# Altium project HW_RV_TOUCH_R1M1.PrjPcb (part 3 of 4)

## Sheet 10_USB_HOST.SchDoc: =TitleParameter
size A3; Address: Crete IL; Organization: ASISGUARD; Address1: Kemalpasa, Kemalpasa Cd. No:290 D:292H, 35060 Bornova/Izmir/Turkey; Revision: R1M1
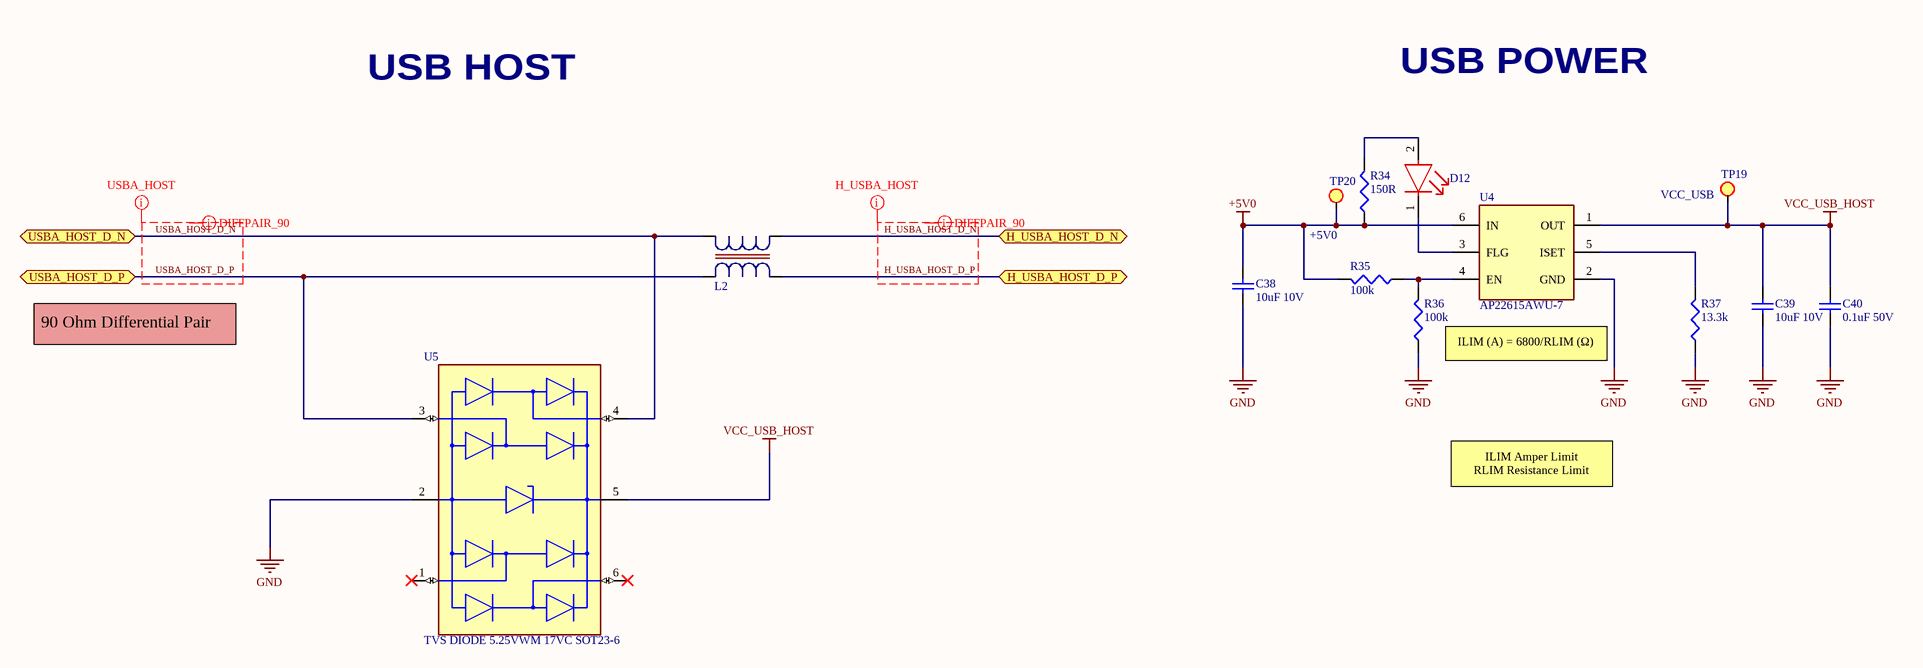
[diagram p9: 10_USB_HOST.SchDoc]

### Parts
C38  value 10uF 10V  [SMC0603]  (hidden comment: CAP CER 10UF 10V X5R 0603)
C39  value 10uF 10V  [SMC0603]  (hidden comment: CAP CER 10UF 10V X5R 0603)
C40  value 0.1uF 50V  [CAP0402(1005)x0.5]  (hidden comment: CAP CER 0.1UF 50V X7R 0402)
D12  LED RED CLEAR SMD  [Lite-On_0_MFG]  (value not drawn)
L2  CMC 100MA 2LN 90 OHM SMD  [IND_MCZ1210AH_TDK]  (value not drawn)
R34  value 150R  [SMR0603]  (hidden comment: RES 150 OHM 1% 1/10W 0603)
R35  value 100k  [RES0402(1005)]  (hidden comment: RES 100K OHM 1% 1/16W 0402)
R36  value 100k  [RES0402(1005)]  (hidden comment: RES 100K OHM 1% 1/16W 0402)
R37  value 13.3k  [RES0402(1005)]  (hidden comment: RES 13.3K OHM 1% 1/16W 0402)
TP19  VCC_USB  [TEST_POINT]
TP20  +5V0  [TEST_POINT]
U4  IC PWR SWTCH N/P-CHAN 1:1 TSOT26  [SOT95P280X100-6N]  (value not drawn)
U5  TVS DIODE 5.25VWM 17VC SOT23-6  [SOT95P280X145-6N]

### Ports
H_USBA_HOST_D_N (bidir), H_USBA_HOST_D_P (bidir), USBA_HOST_D_N (bidir), USBA_HOST_D_P (bidir)

### Nets
+5V0: C38.2 R34.1 R35.2 TP20.1(TP) U4.6(IN)
GND: C38.1 C39.1 C40.1 R36.1 R37.1 U4.2(GND) U5.2(GND)
VCC_USB_HOST: C39.2 C40.2 TP19.1(TP) U4.1(OUT) U5.5(VP)
H_USBA_HOST_D_N: L2.3 ; port H_USBA_HOST_D_N
H_USBA_HOST_D_P: L2.4 ; port H_USBA_HOST_D_P
USBA_HOST_D_N: L2.2 U5.4(I/O3) ; port USBA_HOST_D_N
USBA_HOST_D_P: L2.1 U5.3(I/O2) ; port USBA_HOST_D_P
NetD12_1: D12.1(C) U4.3(FLG)
NetD12_2: D12.2(A) R34.2
NetR35_1: R35.1 R36.2 U4.4(EN)
NetR37_2: R37.2 U4.5(ISET)

Not connected (* = marked no-connect by the designer): U5 1(I/O1)* 6(I/O4)*

### Layout directives
net class USBA_HOST: USBA_HOST_D_N, USBA_HOST_D_P
net class H_USBA_HOST: H_USBA_HOST_D_N, H_USBA_HOST_D_P
differential pair; differential pair class ZDIFF90: H_USBA_HOST_D_N, H_USBA_HOST_D_P, USBA_HOST_D_N, USBA_HOST_D_P

### Notes on the sheet
- USB HOST
- USB POWER
- 90 Ohm Differential Pair
- (near R36) ILIM (A) = 6800/RLIM (Ω)
- ILIM Amper Limit                                                                                     RLIM Resistance Limit
- Proje/Project:
- Sayfa Adı/Document Name:
- Çizilme Tarihi/Drawing Date
- Umit KAYACIK
- Tasarlayan/Designed By
- Sayfa/Sheet:
- Revision:
- of
- Son Güncelleme/Last Edit Date
- Kontrol eden/Checked By
- Onaylayan/Approved By
- Boyut/Size:
- Varyant/Variant:
- Dil/Language:
- A3
- ENG

### Library data of the parts
C38 C39 = CAP0603_10UF_10V: 10 µF ±10% 10V Ceramic Capacitor X5R 0603 (1608 Metric); Manufacturer Part Number: CL10A106KP8NNNC; Order Code: DIGI: 1276-1192-2-ND; Sirius Stock Code: *; LCSC Part Number: C19702; LCSC Manufacturer Part Number: CL10A106KP8NNNC
C40 = CAP0402_0.1UF_50V: 0.1 µF ±10% 50V Ceramic Capacitor X7R 0402 (1005 Metric); Manufacturer Part Number: CL05B104KB54PNC; Order Code: DIGI: 1276-CL05B104KB54PNCTR-ND; Sirius Stock Code: *; LCSC Part Number: C307331; LCSC Manufacturer Part Number: CL05B104KB54PNC
D12 = LTST-C191KRKT: Red 631nm LED Indication - Discrete 2V 0603 (1608 Metric); Order Code: Digi: 160-1447-2-ND; Manufacturer Part Number: LTST-C191KRKT; LCSC Manufacturer Part Number: LTST-C191KRKT; LCSC Part Number: C125099
L2 = MCZ1210AH900L2T: 2 Line Common Mode Choke Surface Mount 90 Ohms @ 100 MHz 100mA DCR 1.75Ohm; Manufacturer Part Number: MCZ1210AH900L2TA0G; LCSC Manufacturer Part Number: MCZ1210AH900L2TD0G; Order Code: Digi: 445-MCZ1210AH900L2TA0GTR-ND; LCSC Part Number: C435268
R34 = RES0603_150R_%1: 150 Ohms ±1% 0.1W, 1/10W Chip Resistor 0603 (1608 Metric) Moisture Resistant Thick Film; Manufacturer Part Number: RC0603FR-07150RL; Order Code: Digi: 311-150HRTR-ND; Sirius Stock Code: *; LCSC Part Number: C114608; LCSC Manufacturer Part Number: RC0603FR-07150RL
R35 R36 = RES0402_100K_%1: 100 kOhms ±1% 0.063W, 1/16W Chip Resistor 0402 (1005 Metric) Moisture Resistant Thick Film; Manufacturer Part Number: RC0402FR-07100KL; Order Code: Digi: 311-100KLRTR-ND; Sirius Stock Code: *; LCSC Part Number: C60491; LCSC Manufacturer Part Number: RC0402FR-07100KL
R37 = RES0402_13K3_%1: Manufacturer Part Number: RC0402FR-0713K3L; Order Code: Digi: YAG2974TR-ND; Sirius Stock Code: *; LCSC Manufacturer Part Number: RC0402FR-0713K3L; LCSC Part Number: C274352
TP19 TP20 = TP_1
U4 = AP22615AWU-7: Power Switch/Driver 1:1 N/P-Channel 3A TSOT-26; Order Code: Digi: AP22615AWU-7DITR-ND; LCSC Manufacturer Part Number: AP22615AWU-7; LCSC Part Number: C2680357; Manufacturer Part Number: AP22615AWU-7
U5 = USBLC6-4SC6: 17V Clamp 5A (8/20µs) Ipp Tvs Diode Surface Mount SOT-23-6; Order Code: Digi: 497-4492-2-ND; Manufacturer Part Number: USBLC6-4SC6; LCSC Manufacturer Part NUmber: USBLC6-4SC6; LCSC Part Number: C111212

## Sheet 11_MYIR.SchDoc: =TitleParameter
size A3; Address: Crete IL; Organization: ASISGUARD; Address1: Kemalpasa, Kemalpasa Cd. No:290 D:292H, 35060 Bornova/Izmir/Turkey; Revision: R1M1
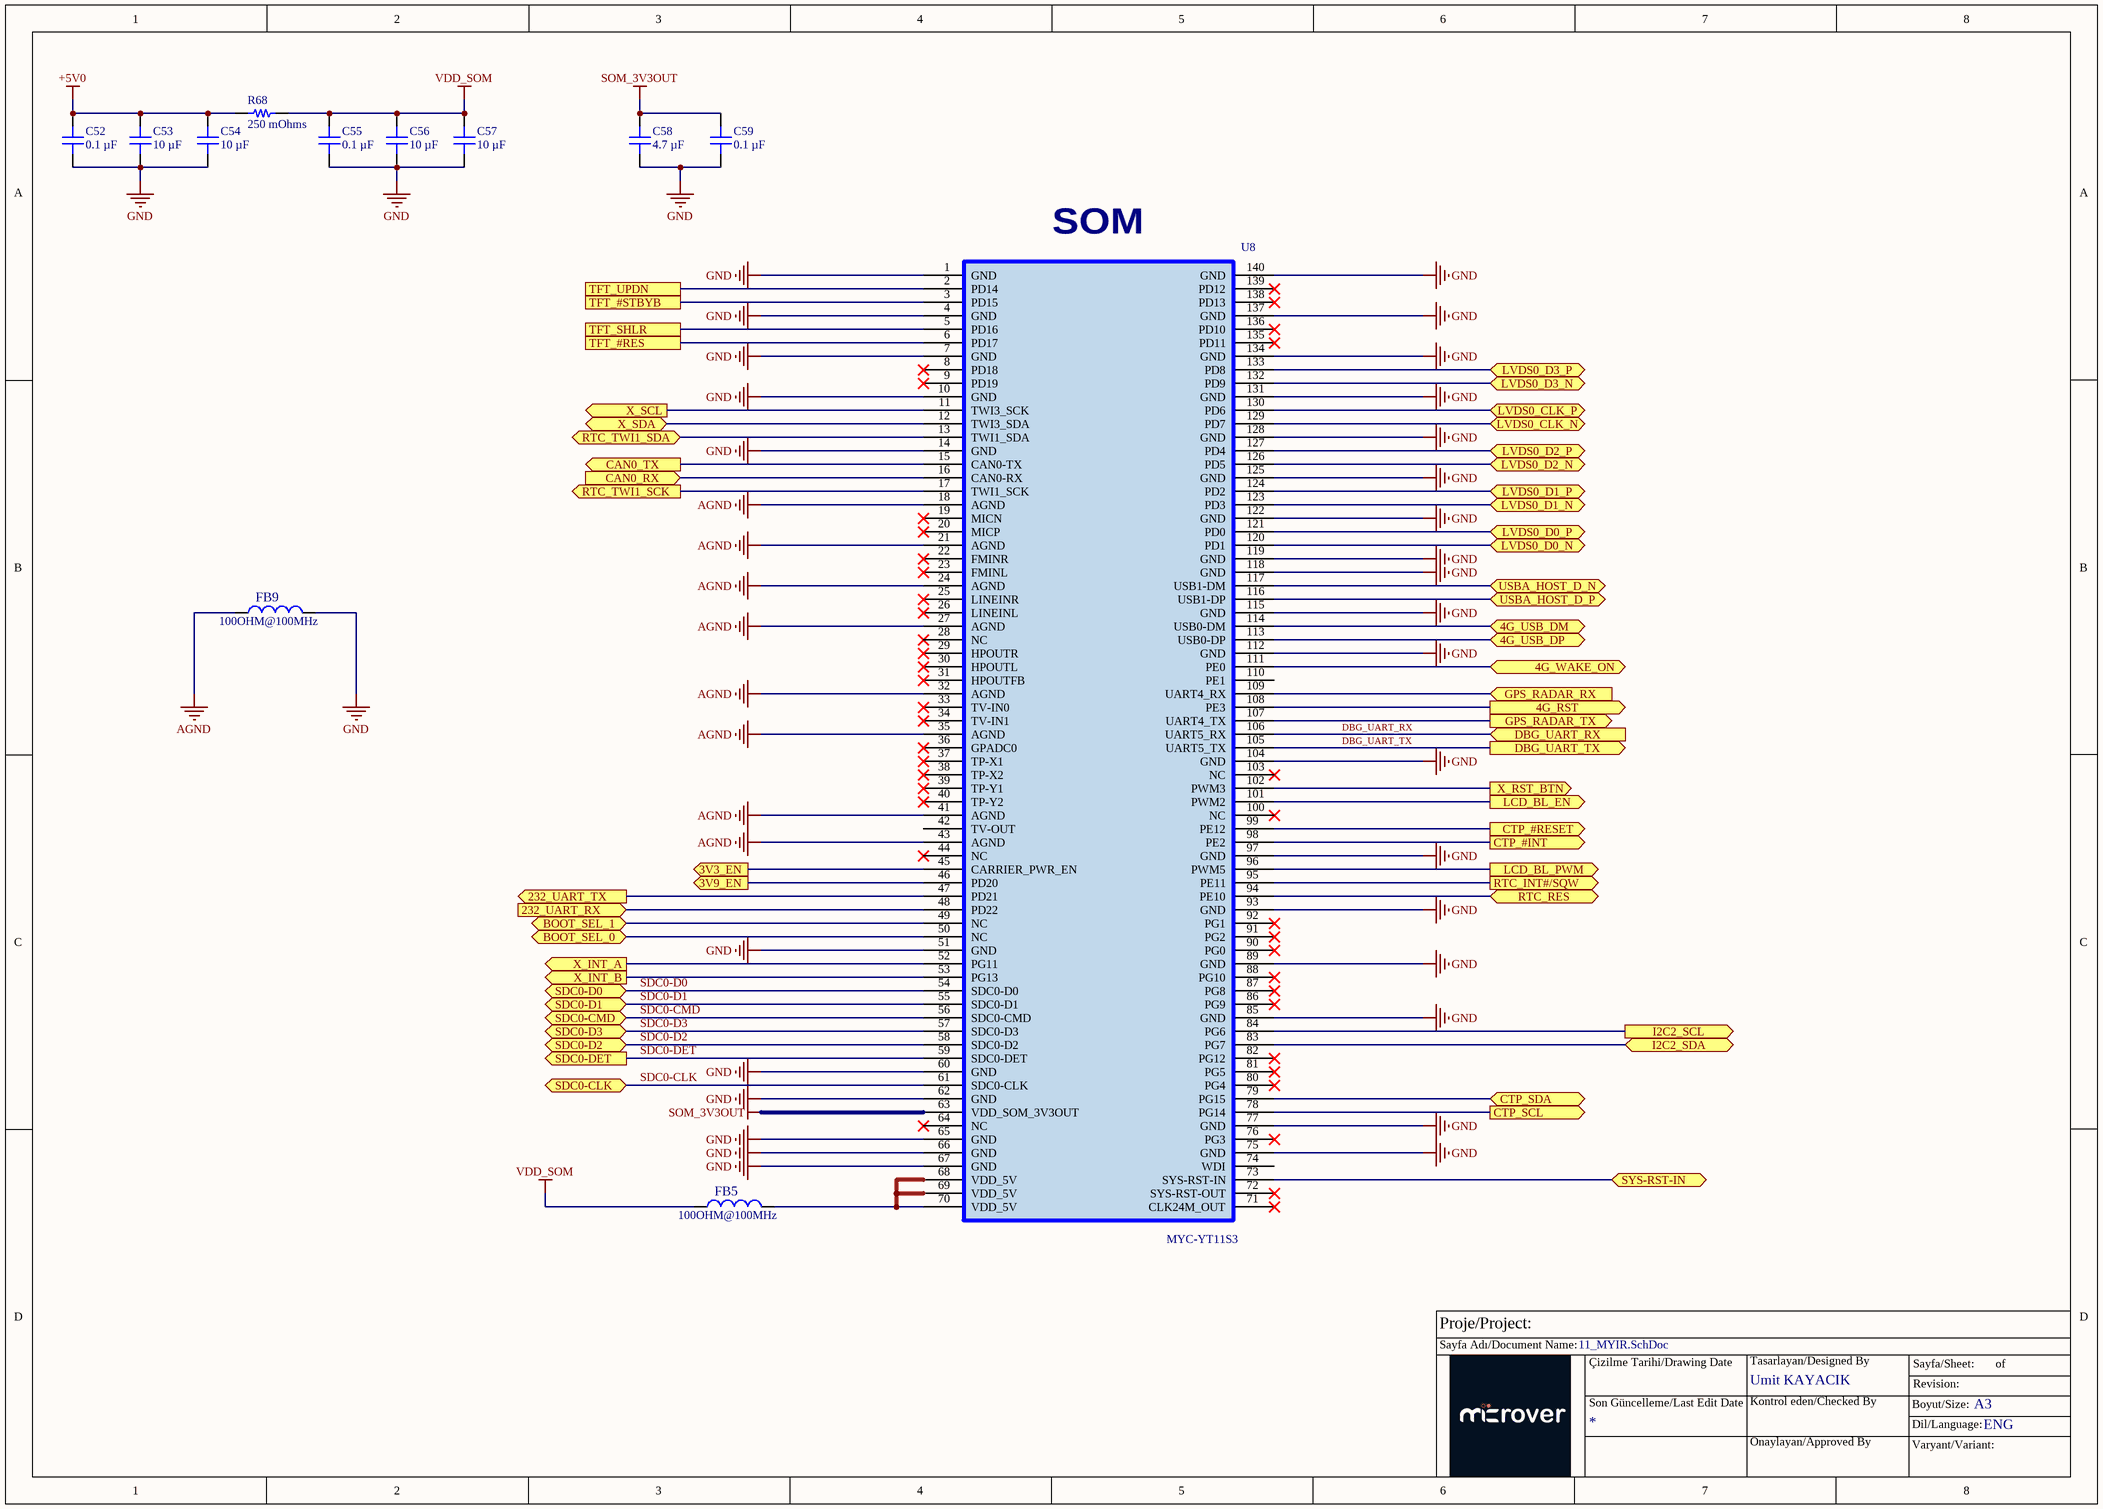
[diagram p10: 11_MYIR.SchDoc]

### Parts
C52  0.1 µF  [CAP 0603_1608]
C53  10 µF  [CAP 0603_1608]
C54  10 µF  [CAP 0603_1608]
C55  0.1 µF  [CAP 0603_1608]
C56  10 µF  [CAP 0603_1608]
C57  10 µF  [CAP 0603_1608]
C58  4.7 µF  [CAP 0603_1608]
C59  0.1 µF  [CAP 0603_1608]
FB5  100OHM@100MHz  [FB 0603(1608)]
FB9  100OHM@100MHz  [FB 0603(1608)]
R68  250 mOhms  [RES 1206_3216]
U8  MYC-YT11S3  [YOUPK37X39_1_00-SMD-148]

### Ports
3V3_EN (out), 3V9_EN (out), 4G_RST (out), 4G_USB_DM (bidir), 4G_USB_DP (bidir), 4G_WAKE_ON (bidir), 232_UART_RX (in), 232_UART_TX (out), BOOT_SEL_0 (bidir), BOOT_SEL_1 (bidir), CAN0_RX (in), CAN0_TX (out), CTP_#INT (out), CTP_#RESET (out), CTP_SCL (out), CTP_SDA (bidir), DBG_UART_RX (in), DBG_UART_TX (out), GPS_RADAR_RX (in), GPS_RADAR_TX (out), I2C2_SCL (out), I2C2_SDA (bidir), LCD_BL_EN (out), LCD_BL_PWM (out), LVDS0_CLK_N (bidir), LVDS0_CLK_P (bidir), LVDS0_D0_N (bidir), LVDS0_D0_P (bidir), LVDS0_D1_N (bidir), LVDS0_D1_P (bidir), LVDS0_D2_N (bidir), LVDS0_D2_P (bidir), LVDS0_D3_N (bidir), LVDS0_D3_P (bidir), RTC_INT#/SQW (out), RTC_RES (bidir), RTC_TWI1_SCK (out), RTC_TWI1_SDA (bidir), SDC0-CLK (bidir), SDC0-CMD (bidir), SDC0-D0 (bidir), SDC0-D1 (bidir), SDC0-D2 (bidir), SDC0-D3 (bidir), SDC0-DET (out), SYS-RST-IN (bidir), TFT_#RES, TFT_#STBYB, TFT_SHLR, TFT_UPDN, USBA_HOST_D_N (bidir), USBA_HOST_D_P (bidir), X_INT_A (out), X_INT_B (out), X_RST_BTN (out), X_SCL (out), X_SDA (bidir)

### Nets
+5V0: C52.2 C53.2 C54.2 R68.2
AGND: FB9.2 U8.18(AGND) U8.21(AGND) U8.24(AGND) U8.27(AGND) U8.32(AGND) U8.35(AGND) U8.41(AGND) U8.43(AGND)
GND: C52.1 C53.1 C54.1 C55.1 C56.1 C57.1 C58.1 C59.1 FB9.1 U8.1(GND) U8.4(GND) U8.7(GND) U8.10(GND) U8.14(GND) U8.51(GND) U8.60(GND) U8.62(GND) U8.65(GND) U8.66(GND) U8.67(GND) U8.75(GND) U8.77(GND) U8.85(GND) U8.89(GND) U8.93(GND) U8.97(GND) U8.104(GND) U8.112(GND) U8.115(GND) U8.118(GND) U8.119(GND) U8.122(GND) U8.125(GND) U8.128(GND) U8.131(GND) U8.134(GND) U8.137(GND) U8.140(GND)
SOM_3V3OUT: C58.2 C59.2 U8.63(VDD_SOM_3V3OUT)
VDD_SOM: C55.2 C56.2 C57.2 FB5.2 R68.1
4G_RST: U8.108(PE3) ; port 4G_RST
4G_USB_N: U8.114(USB0-DM) ; port 4G_USB_DM
4G_USB_P: U8.113(USB0-DP) ; port 4G_USB_DP
CTP_#INT: U8.98(PE2) ; port CTP_#INT
CTP_#RESET: U8.99(PE12) ; port CTP_#RESET
CTP_SCL: U8.78(PG14) ; port CTP_SCL
CTP_SDA: U8.79(PG15) ; port CTP_SDA
DBG_UART_RX: U8.106(UART5_RX) ; port DBG_UART_RX
DBG_UART_TX: U8.105(UART5_TX) ; port DBG_UART_TX
I2C2_SCL: U8.84(PG6) ; port I2C2_SCL
I2C2_SDA: U8.83(PG7) ; port I2C2_SDA
INT#/SQW: U8.95(PE11) ; port RTC_INT#/SQW
LCD_BL_EN: U8.101(PWM2) ; port LCD_BL_EN
LCD_BL_PWM: U8.96(PWM5) ; port LCD_BL_PWM
LVDS0_CLK_N: U8.129(PD7) ; port LVDS0_CLK_N
LVDS0_CLK_P: U8.130(PD6) ; port LVDS0_CLK_P
LVDS0_D0_N: U8.120(PD1) ; port LVDS0_D0_N
LVDS0_D0_P: U8.121(PD0) ; port LVDS0_D0_P
LVDS0_D1_N: U8.123(PD3) ; port LVDS0_D1_N
LVDS0_D1_P: U8.124(PD2) ; port LVDS0_D1_P
LVDS0_D2_N: U8.126(PD5) ; port LVDS0_D2_N
LVDS0_D2_P: U8.127(PD4) ; port LVDS0_D2_P
LVDS0_D3_N: U8.132(PD9) ; port LVDS0_D3_N
LVDS0_D3_P: U8.133(PD8) ; port LVDS0_D3_P
RST_BTN: U8.102(PWM3) ; port X_RST_BTN
RTC_RES: U8.94(PE10) ; port RTC_RES
SDC0-CLK: U8.61(SDC0-CLK) ; port SDC0-CLK
SDC0-CMD: U8.56(SDC0-CMD) ; port SDC0-CMD
SDC0-D0: U8.54(SDC0-D0) ; port SDC0-D0
SDC0-D1: U8.55(SDC0-D1) ; port SDC0-D1
SDC0-D2: U8.58(SDC0-D2) ; port SDC0-D2
SDC0-D3: U8.57(SDC0-D3) ; port SDC0-D3
SDC0-DET: U8.59(SDC0-DET) ; port SDC0-DET
TFT_#RES: U8.6(PD17) ; port TFT_#RES
TFT_#STBYB: U8.3(PD15) ; port TFT_#STBYB
TFT_SHLR: U8.5(PD16) ; port TFT_SHLR
TFT_UPDN: U8.2(PD14) ; port TFT_UPDN
USBA_HOST_D_N: U8.117(USB1-DM) ; port USBA_HOST_D_N
USBA_HOST_D_P: U8.116(USB1-DP) ; port USBA_HOST_D_P
NetC49_2: U8.73(SYS-RST-IN) ; port SYS-RST-IN
NetFB5_1: FB5.1 U8.68(VDD_5V) U8.69(VDD_5V) U8.70(VDD_5V)
NetIC4_12: U8.11(TWI3_SCK) ; port X_SCL
NetIC4_13: U8.12(TWI3_SDA) ; port X_SDA
NetIC4_19: U8.53(PG13) ; port X_INT_B
NetIC4_20: U8.52(PG11) ; port X_INT_A
NetP1_7: U8.109(UART4_RX) ; port GPS_RADAR_RX
NetP1_9: U8.107(UART4_TX) ; port GPS_RADAR_TX
NetP2_5: U8.47(PD21) ; port 232_UART_TX
NetP2_7: U8.48(PD22) ; port 232_UART_RX
NetP2_11: U8.15(CAN0-TX) ; port CAN0_TX
NetP2_13: U8.16(CAN0-RX) ; port CAN0_RX
NetR13_1: U8.46(PD20) ; port 3V9_EN
NetR15_1: U8.45(CARRIER_PWR_EN) ; port 3V3_EN
NetR16_1: U8.111(PE0) ; port 4G_WAKE_ON
NetR56_1: U8.13(TWI1_SDA) ; port RTC_TWI1_SDA
NetR57_1: U8.17(TWI1_SCK) ; port RTC_TWI1_SCK
NetR95_1: U8.50(NC) ; port BOOT_SEL_0
NetR97_1: U8.49(NC) ; port BOOT_SEL_1

Not connected (* = marked no-connect by the designer): U8 8(PD18)* 9(PD19)* 19(MICN)* 20(MICP)* 22(FMINR)* 23(FMINL)* 25(LINEINR)* 26(LINEINL)* 28(NC)* 29(HPOUTR)* 30(HPOUTL)* 31(HPOUTFB)* 33(TV-IN0)* 34(TV-IN1)* 36(GPADC0)* 37(TP-X1)* 38(TP-X2)* 39(TP-Y1)* 40(TP-Y2)* 42(TV-OUT) 44(NC)* 64(NC)* 71(CLK24M_OUT)* 72(SYS-RST-OUT)* 74(WDI) 76(PG3)* 80(PG4)* 81(PG5)* 82(PG12)* 86(PG9)* 87(PG8)* 88(PG10)* 90(PG0)* 91(PG2)* 92(PG1)* 100(NC)* 103(NC)* 110(PE1) 135(PD11)* 136(PD10)* 138(PD13)* 139(PD12)*

### Notes on the sheet
- (near U8) SOM
- POWER OUTPUT
- (near FB5) POWER INPUT
- Proje/Project:
- Sayfa Adı/Document Name:
- Çizilme Tarihi/Drawing Date
- Umit KAYACIK
- Tasarlayan/Designed By
- Sayfa/Sheet:
- Revision:
- of
- Son Güncelleme/Last Edit Date
- Kontrol eden/Checked By
- Onaylayan/Approved By
- Boyut/Size:
- Varyant/Variant:
- Dil/Language:
- A3
- ENG

### Library data of the parts
C52 C55 C59 = VJ0603Y104MXJPW1BC: CAP CER 0.1UF 16V X7R 0603; manufacturer: Vishay Vitramon; Tolerance: ±20%; Part Number: VJ0603Y104MXJPW1BC; Value: 0.1 µF; Applications: General Purpose; Capacitance: 0.1 µF; componentlink1description: Datasheet; componentlink1url: https://www.vishay.com/docs/28548/vjw1bcbascomseries.pdf; componentlink2description: DigiKey Link; componentlink2url: https://www.digikey.com/en/products/detail/vishay-vitramon/VJ0603Y104MXJPW1BC/8305322; Device Package: 0603 (1608 Metric); lastupdated: 2/9/2024 8:09:54 PM; Lifecycle Status: Active; Minimum Order: 1; Mounting Type: Surface Mount, MLCC; Operating Temperature: -55°C ~ 125°C; Package / Case: 0603 (1608 Metric); packaging: TapeAndReel; partid: 34420; Part Status: Active; price: 0.01; series: VJ W1BC; Size / Dimension: 0.063" L x 0.031" W (1.60mm x 0.80mm); Supplier 1: DigiKey; Supplier Part Number 1: 720-VJ0603Y104MXJPW1BCCT-ND; Temperature Coefficient: X7R; Thickness (Max): 0.034" (0.87mm); Voltage - Rated: 16V
C53 C54 C56 C57 = ZRB18AR61C106ME01L: CAP CER 10UF 16V X5R 0603; manufacturer: Murata Electronics; Tolerance: ±20%; Part Number: ZRB18AR61C106ME01L; Value: 10 µF; Applications: Acoustic Noise Reduction; Capacitance: 10 µF; componentlink1description: Datasheet; componentlink1url: https://search.murata.co.jp/Ceramy/image/img/A01X/G101/ENG/ZRB18AR61C106ME01-01.pdf; componentlink2description: DigiKey Link; componentlink2url: https://www.digikey.com/en/products/detail/murata-electronics/ZRB18AR61C106ME01L/5321082; Device Package: 0603 (1608 Metric); Features: Interposer Termination; lastupdated: 2/9/2024 8:10:10 PM; Lifecycle Status: Active; Minimum Order: 1; Mounting Type: Surface Mount, MLCC; Operating Temperature: -55°C ~ 85°C; Package / Case: 0603 (1608 Metric); packaging: TapeAndReel; partid: 16007; Part Status: Active; price: 0.08; series: ZRB; Size / Dimension: 0.063" L x 0.031" W (1.60mm x 0.80mm); Supplier 1: DigiKey; Supplier Part Number 1: 490-10990-1-ND; Temperature Coefficient: X5R; Thickness (Max): 0.047" (1.20mm); Voltage - Rated: 16V
C58 = KGM15BR51C475KT: CAP CER 4.7UF 16V X5R 0603; manufacturer: KYOCERA AVX; Tolerance: ±10%; Part Number: KGM15BR51C475KT; Value: 4.7 µF; Applications: General Purpose; Capacitance: 4.7 µF; componentlink1description: Datasheet; componentlink1url: https://datasheets.kyocera-avx.com/cx5r.pdf; componentlink2description: DigiKey Link; componentlink2url: https://www.digikey.com/en/products/detail/kyocera-avx/KGM15BR51C475KT/9748483; Device Package: 0603 (1608 Metric); lastupdated: 2/9/2024 8:09:11 PM; Lifecycle Status: Active; Minimum Order: 1; Mounting Type: Surface Mount, MLCC; Operating Temperature: -55°C ~ 85°C; Package / Case: 0603 (1608 Metric); packaging: TapeAndReel; partid: 53181; Part Status: Active; price: 0.09; series: KGM - X5R; Size / Dimension: 0.063" L x 0.031" W (1.60mm x 0.80mm); Supplier 1: DigiKey; Supplier Part Number 1: 478-KGM15BR51C475KTCT-ND; Temperature Coefficient: X5R; Thickness (Max): 0.037" (0.95mm); Voltage - Rated: 16V
FB5 FB9 = FB0603_100OHM_100MHz: 100 Ohms @ 100 MHz 1 Power Line Ferrite Bead 0603 (1608 Metric) 2A 40mOhm; Manufacturer: TDK; Manufacturer Part Number: MPZ1608Y101BTA00; Tolerance: 25%; Impedance: 100R; DC Resistance (DCR): 40mR; ComponentLink1URL: https://chn-vm-apps.microchip.com/mchprepo/parts/Datasheets/beads_commercial_power_mpz_en.pdf; ComponentLink1Description: Datasheet; Supplier 1: Digi-Key; Supplier Part Number 1: 445-2984-1-ND; RoHS: Yes; Category: Ferrite Beads and Chips; Stock 1: 551; Pricing 1: 1=0,10000, 10=0,07200, 25=0,06480, 50=0,05840, 100=0,04290, 250=0,03120, 500=0,02860, 1000=0,02470 (USD); Mount: Surface Mount; Case/Package: 0603; Case Code (Metric): 1608; Case Code (Imperial): 0603; Core Material: Ferrite; Packaging: Tape and Reel; Package Quantity: 4000; Max DC Current: 2A; Current Rating: 2A; Series: MPZ; Length: 0.063inch; Width: 0.031inch; Height: 0.037inch; RoHS Compliant: Yes; REACH SVHC: No SVHC; ComponentLink2URL: https://datasheet.ciiva.com/46634/beads-commercial-power-mpz-en-46634677.pdf?src-supplier=Digi-Key; ComponentLink2Description: https://datasheet.ciiva.com/46634/beads-commercial-power-mpz-en-46634677.pdf?src-supplier=Digi-Key; ComponentLink3URL: https://datasheet.ciiva.com/48682/beads-commercial-power-mpz-en-48682501.pdf?src-supplier=Avnet; ComponentLink3Description: https://datasheet.ciiva.com/48682/beads-commercial-power-mpz-en-48682501.pdf?src-supplier=Avnet; ComponentLink4URL: https://datasheet.ciiva.com/46634/beads-commercial-power-mpz-en-46634684.pdf?src-supplier=Digi-Key; ComponentLink4Description: https://datasheet.ciiva.com/46634/beads-commercial-power-mpz-en-46634684.pdf?src-supplier=Digi-Key; ComponentLink5URL: https://datasheet.ciiva.com/46634/beads-commercial-power-mpz-en-46634621.pdf?src-supplier=Digi-Key; ComponentLink5Description: https://datasheet.ciiva.com/46634/beads-commercial-power-mpz-en-46634621.pdf?src-supplier=Digi-Key; Parameter 1: *; LCSC Manufacturer Part Number: MPZ1608Y101BTA00; LCSC Part Number: C501996
R68 = MFHA1206R2500FC: RES 0.25 OHM 1% 1W 1206; Manufacturer: Eaton - Electronics Division; Temperature Coefficient: ±100ppm/°C; Part Number: MFHA1206R2500FC; ComponentLink1Description: Datasheet; ComponentLink1URL: https://www.eaton.com/content/dam/eaton/products/electronic-components/resources/data-sheet/eaton-mfha-automotive-smd-current-sense-resistor-metal-film-data-sheet-elx1178.pdf; ComponentLink2Description: DigiKey Link; ComponentLink2URL: https://www.digikey.com/en/products/detail/eaton-electronics-division/MFHA1206R2500FC/16713465; Composition: Metal Film; Device Package: 1206 (3216 Metric); Features: Automotive AEC-Q200, Current Sense, Moisture Resistant; Height - Seated (Max): 0.026" (0.65mm); LastUpdated: 2/9/2024 8:53:03 PM; Lifecycle Status: Active; Minimum Order: 1; Number of Terminations: 2; Operating Temperature: -55°C ~ 155°C; Package / Case: 1206 (3216 Metric); Packaging: TapeAndReel; PartId: 72444; Part Status: Active; Power (Watts): 1W; Price: 0.04; Ratings: AEC-Q200; Resistance: 250 mOhms; Series: MFHA; Size / Dimension: 0.126" L x 0.063" W (3.20mm x 1.60mm); Supplier 1: DigiKey; Supplier Part Number 1: 283-MFHA1206R2500FCCT-ND; Supplier Device Package: 1206; Tolerance: ±1%; Value: 250 mOhms
U8 = AM335X_QFN_4: PCB Footprint: youpk37x39_1_00-smd-148

## Sheet 12_PERIPHERALS.SchDoc: =TitleParameter
size A3; Address: Crete IL; Organization: ASISGUARD; Address1: Kemalpasa, Kemalpasa Cd. No:290 D:292H, 35060 Bornova/Izmir/Turkey; Revision: R1M1
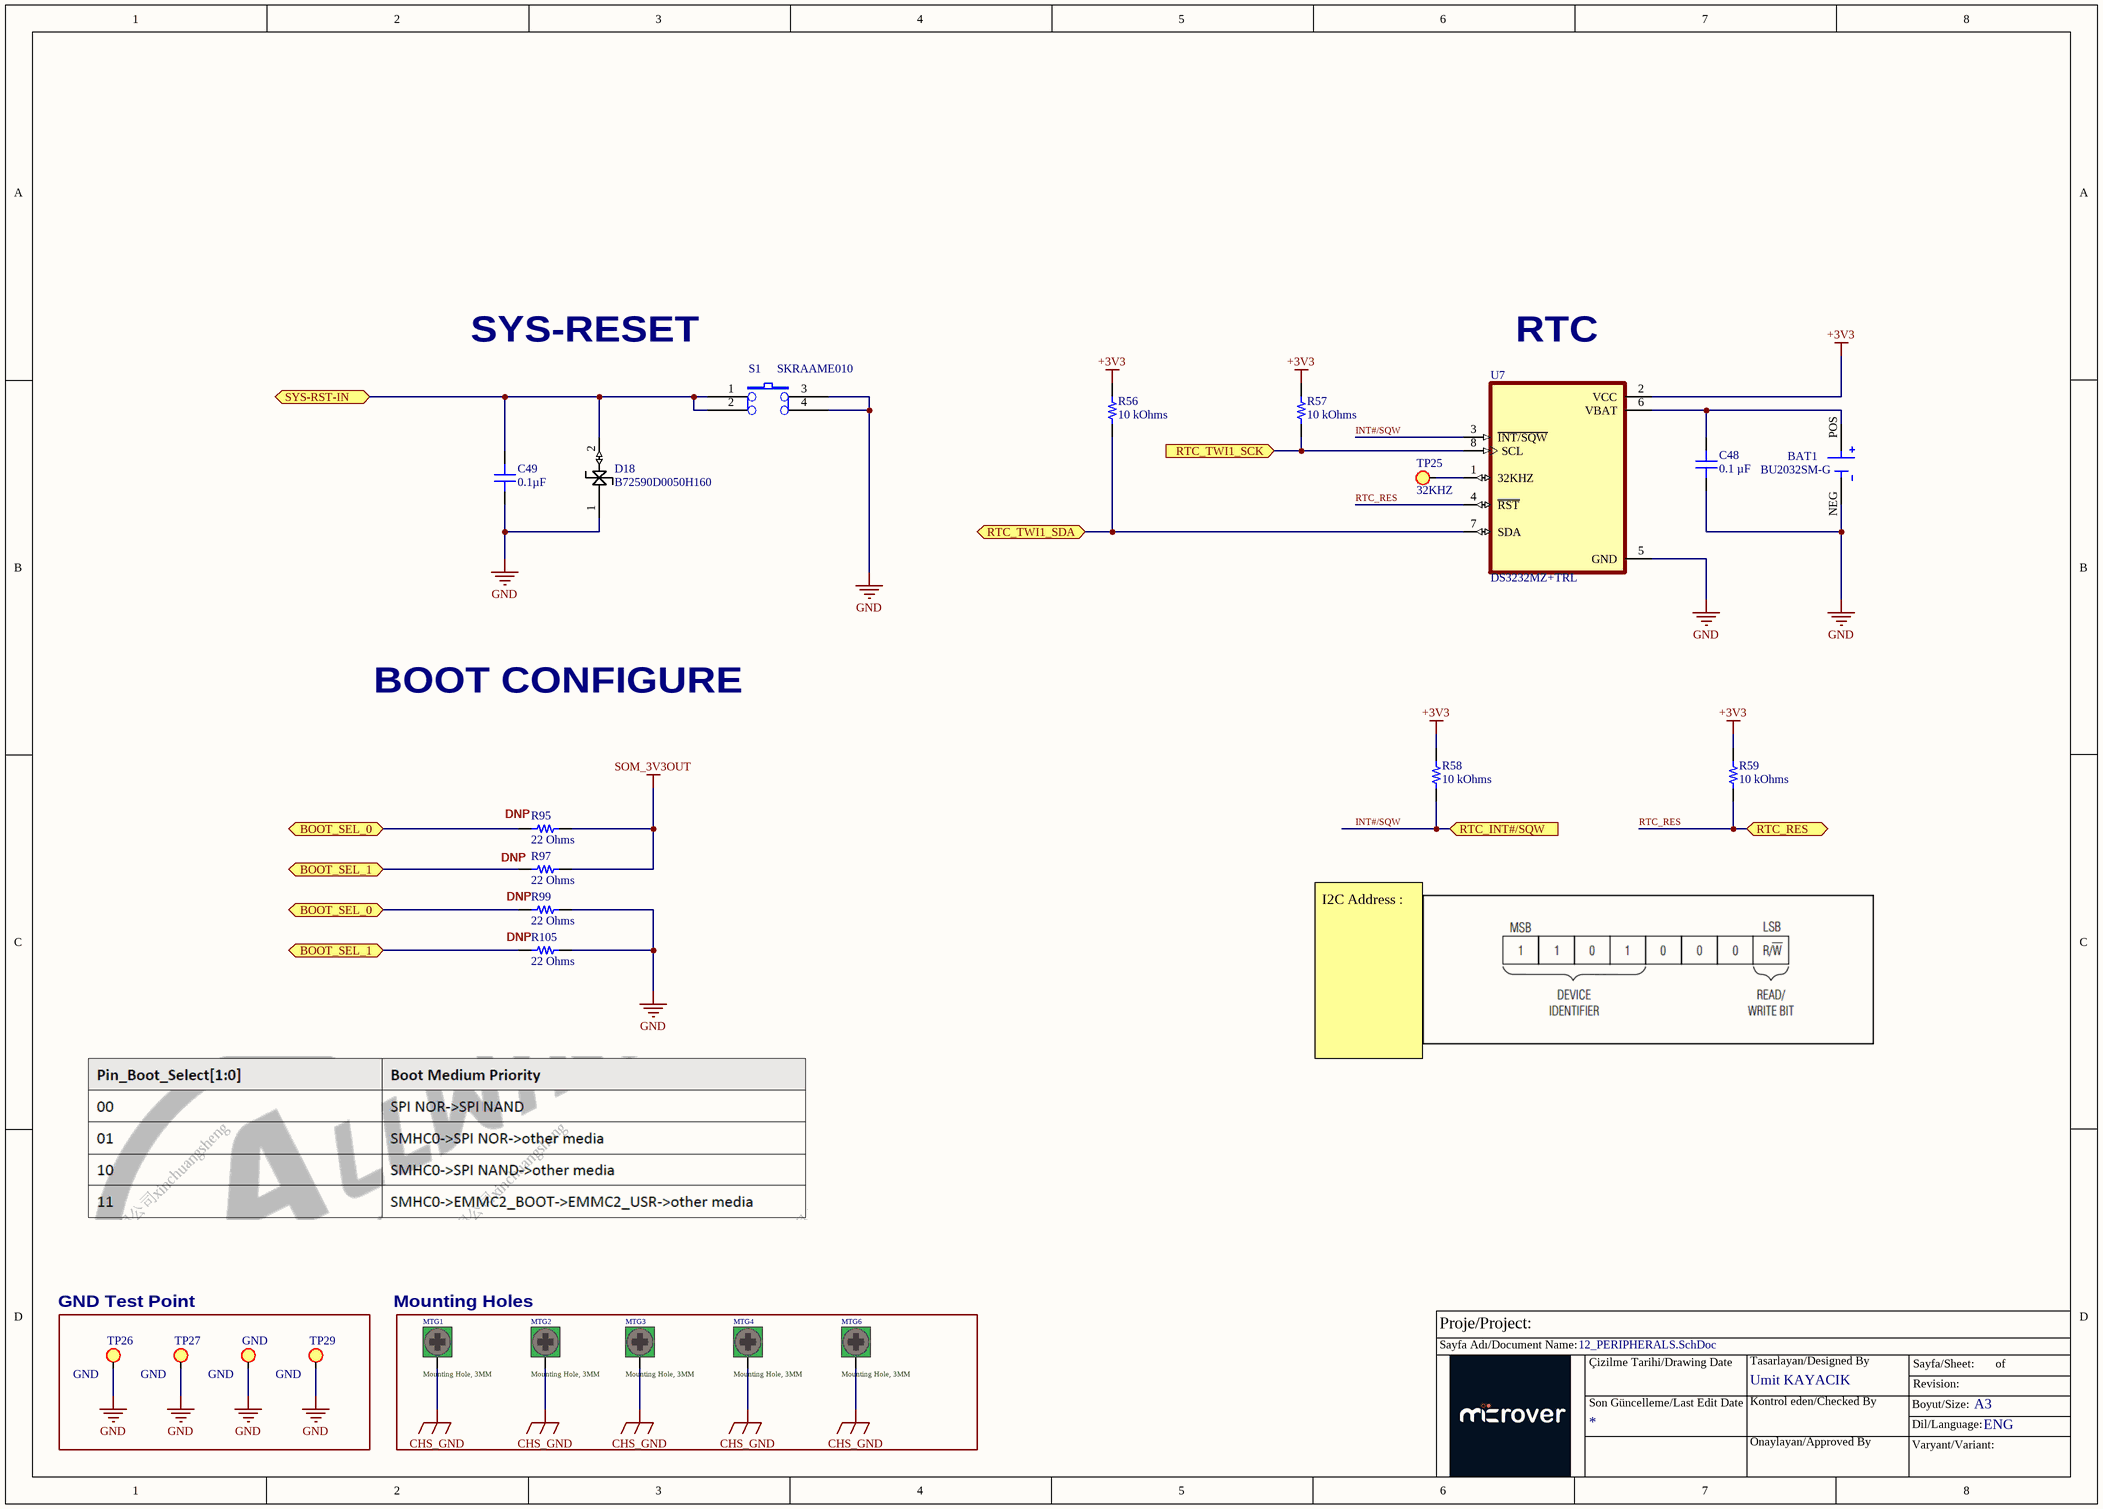
[diagram p11: 12_PERIPHERALS.SchDoc]

### Parts
BAT1  BU2032SM-G  [BAT_BU2032SM-G]
C48  0.1 µF  [CAP 0402_1005]
C49  0.1µF  [CAP 0603_1608]
D18  B72590D0050H160  [SOD1005X60N]
GND  GND  [TEST_POINT]
MTG1  Mounting Hole, 3MM  [MTG-PTH-3MM]  (no BOM)
MTG2  Mounting Hole, 3MM  [MTG-PTH-3MM]  (no BOM)
MTG3  Mounting Hole, 3MM  [MTG-PTH-3MM]  (no BOM)
MTG4  Mounting Hole, 3MM  [MTG-PTH-3MM]  (no BOM)
MTG6  Mounting Hole, 3MM  [MTG-PTH-3MM]  (no BOM)
R56  10 kOhms  [RES 0402_1005]
R57  10 kOhms  [RES 0402_1005]
R58  10 kOhms  [RES 0402_1005]
R59  10 kOhms  [RES 0402_1005]
R95  22 Ohms  [RES 0402_1005]
R97  22 Ohms  [RES 0402_1005]
R99  22 Ohms  [RES 0402_1005]
R105  22 Ohms  [RES 0402_1005]
S1  SKRAAME010  [SKRAAME010 - duplicate]
TP25  32KHZ  [TEST_POINT]
TP26  GND  [TEST_POINT]
TP27  GND  [TEST_POINT]
TP29  GND  [TEST_POINT]
U7  DS3232MZ+TRL  [SOIC127P600X175-8N - duplicate1]

### Blocks framed on the sheet
GND Test Point: GND TP26 TP27 TP29
Mounting Holes: MTG1-MTG4 MTG6

### Ports
BOOT_SEL_0 (bidir), BOOT_SEL_1 (bidir), RTC_INT#/SQW (in), RTC_RES (bidir), RTC_TWI1_SCK (in), RTC_TWI1_SDA (bidir), SYS-RST-IN (bidir)

### Nets
+3V3: R56.2 R57.2 R58.2 R59.2 U7.2(VCC)
CHS_GND: MTG1.0 MTG2.0 MTG3.0 MTG4.0 MTG6.0
GND: BAT1.NEG C48.1 C49.1 D18.1(GND) GND.1(TP) R99.2 R105.2 S1.3 S1.4 TP26.1(TP) TP27.1(TP) TP29.1(TP) U7.5(GND)
SOM_3V3OUT: R95.2 R97.2
INT#/SQW: R58.1 U7.3(~{INT/SQW}) ; port RTC_INT#/SQW
RTC_RES: R59.1 U7.4(~{RST}) ; port RTC_RES
NetBAT1_POS: BAT1.POS C48.2 U7.6(VBAT)
NetC49_2: C49.2 D18.2(I/OLINE) S1.1 S1.2 ; port SYS-RST-IN
NetR56_1: R56.1 U7.7(SDA) ; port RTC_TWI1_SDA
NetR57_1: R57.1 U7.8(SCL) ; port RTC_TWI1_SCK
NetR95_1: R95.1 R99.1 ; port BOOT_SEL_0
NetR97_1: R97.1 R105.1 ; port BOOT_SEL_1
NetTP25_1: TP25.1(TP) U7.1(32KHZ)

### Notes on the sheet
- SYS-RESET
- (near U7) RTC
- BOOT CONFIGURE
- (near R95) DNP
- (near R97) DNP
- (near R99) DNP
- (near R105) DNP
- I2C Address :
- Proje/Project:
- Sayfa Adı/Document Name:
- Çizilme Tarihi/Drawing Date
- Umit KAYACIK
- Tasarlayan/Designed By
- Sayfa/Sheet:
- Revision:
- of
- Son Güncelleme/Last Edit Date
- Kontrol eden/Checked By
- Onaylayan/Approved By
- Boyut/Size:
- Varyant/Variant:
- Dil/Language:
- A3
- ENG

### Library data of the parts
BAT1 = BU2032SM-G: Battery Holder Coin 20MM SMD; Manufacturer: Memory Protection Devices; Number of Cells: 1; Number of Contacts: 2NUMBER; Supplier 1: Digikey; Manufacturer Part Number: BU2032SM-G; RoHS: Yes; Category: Uncategorized; Stock 1: 17897; Pricing 1: 400=0.81163, 800=0.76195, 1200=0.71225, 2800=0.646, 10000=0.5963 (USD); Mount: Surface Mount,PCB; Case/Package: SMD/SMT; Contact Material: 153,157ConductorMaterial; Min Operating Temperature: -40°C; Max Operating Temperature: 315°C; Termination: SMD/SMT; Series: -; Packaging: Cut Tape; Height: 5.3mm; ComponentLink1URL: https://datasheet.ciiva.com/7613/bu2032sm-g-datasheet-7613472.pdf?src-supplier=Digikey; ComponentLink1Description: https://datasheet.ciiva.com/7613/bu2032sm-g-datasheet-7613472.pdf?src-supplier=Digikey; Supplier Part Number 1: BU2032SM-GTR-ND
C48 = 885012105001: CAP CER 0.1UF 6.3V X5R 0402; manufacturer: Würth Elektronik; Tolerance: ±20%; Part Number: 885012105001; Value: 0.1 µF; Applications: General Purpose; Capacitance: 0.1 µF; componentlink1description: Datasheet; componentlink1url: https://katalog.we-online.de/pbs/datasheet/885012105001.pdf; componentlink2description: DigiKey Link; componentlink2url: https://www.digikey.com/en/products/detail/würth-elektronik/885012105001/5453333; Device Package: 0402 (1005 Metric); lastupdated: 2/9/2024 8:04:37 PM; Lifecycle Status: Active; Minimum Order: 1; Mounting Type: Surface Mount, MLCC; Operating Temperature: -55°C ~ 85°C; Package / Case: 0402 (1005 Metric); packaging: TapeAndReel; partid: 1931; Part Status: Active; price: 0.01; series: WCAP-CSGP; Size / Dimension: 0.039" L x 0.020" W (1.00mm x 0.50mm); Supplier 1: DigiKey; Supplier Part Number 1: 732-7478-1-ND; Temperature Coefficient: X5R; Thickness (Max): 0.022" (0.55mm); Voltage - Rated: 6.3V
C49 = ESD35C104K4T2A-24: CAP CER 0.1UF 50V X7R 0603; manufacturer: AVX Corporation; Tolerance: ±10%; Part Number: ESD35C104K4T2A-24; Value: 0.1µF; Applications: Automotive, ESD Protection; Capacitance: 0.1µF; componentlink1description: Datasheet; componentlink1url: http://datasheets.avx.com/ESDSafe.pdf; componentlink2description: DigiKey Link; componentlink2url: http://digikey.com/product-detail/en/avx-corporation/ESD35C104K4T2A-24/478-8009-1-ND/3902999; Device Package: 0603 (1608 Metric); lastupdated: 9/2/2020 1:03:10 AM; Lifecycle Status: Active; Minimum Order: 1; Mounting Type: Surface Mount, MLCC; Operating Temperature: -55°C ~ 125°C; Package / Case: 0603 (1608 Metric); packaging: TapeAndReel; partid: 15342; Part Status: Active; price: 0.03; Ratings: AEC-Q200; series: ESD-SAFE™; Size / Dimension: 0.063" L x 0.031" W (1.60mm x 0.80mm); Supplier 1: DigiKey; Supplier Part Number 1: 478-8009-1-ND; Temperature Coefficient: X7R; Voltage - Rated: 50V
D18 = B72590D0050H160: VARISTOR 150V 0402; Manufacturer: TDK EPCOS; Supplier 1: Digikey; Manufacturer Part Number: B72590D0050H160; RoHS: Yes; Category: Varistors; Stock 1: 130000; Pricing 1: 10000=0,04977, 30000=0,04666, 50000=0,04137, 100000=0,04044, 250000=0,03982 (USD); ComponentLink1URL: https://datasheet.octopart.com/B72590D0050H160-EPCOS-datasheet-10468447.pdf?src-supplier=Newark; ComponentLink1Description: https://datasheet.octopart.com/B72590D0050H160-EPCOS-datasheet-10468447.pdf?src-supplier=Newark; ComponentLink2URL: https://en.tdk.eu/inf/75/ds/High_speed_series.pdf?src-supplier=Verical; ComponentLink2Description: https://en.tdk.eu/inf/75/ds/High_speed_series.pdf?src-supplier=Verical; ComponentLink3URL: http://www.farnell.com/datasheets/1706828.pdf?src-supplier=Newark; ComponentLink3Description: http://www.farnell.com/datasheets/1706828.pdf?src-supplier=Newark; ComponentLink4URL: https://en.tdk.eu/inf/75/ds/High_speed_series.pdf?src-supplier=Digikey; ComponentLink4Description: https://en.tdk.eu/inf/75/ds/High_speed_series.pdf?src-supplier=Digikey; ComponentLink5URL: https://www.tdk-electronics.tdk.com/inf/75/ds/High_speed_series.pdf?src-supplier=Digikey; ComponentLink5Description: https://www.tdk-electronics.tdk.com/inf/75/ds/High_speed_series.pdf?src-supplier=Digikey; ComponentLink6URL: https://en.tdk.eu/inf/75/ds/High_speed_series.pdf?src-supplier=Arrow+Electronics; ComponentLink6Description: https://en.tdk.eu/inf/75/ds/High_speed_series.pdf?src-supplier=Arrow+Electronics; ComponentLink7URL: https://en.tdk.eu/inf/75/ds/High_speed_series.pdf?src-supplier=Quest; ComponentLink7Description: https://en.tdk.eu/inf/75/ds/High_speed_series.pdf?src-supplier=Quest; ComponentLink8URL: https://datasheet.octopart.com/B72590D0050H160-EPCOS-datasheet-157245974.pdf?src-supplier=LKR; ComponentLink8Description: https://datasheet.octopart.com/B72590D0050H160-EPCOS-datasheet-157245974.pdf?src-supplier=LKR; ComponentLink9URL: https://en.tdk.eu/inf/75/ds/High_speed_series.pdf?src-supplier=TTI; ComponentLink9Description: https://en.tdk.eu/inf/75/ds/High_speed_series.pdf?src-supplier=TTI; Supplier Part Number 1: 495-3684-2-ND
GND TP25-TP27 TP29 = TP_1
MTG1-MTG4 MTG6 = MTG3MM
R56-R59 = RP73PF1E10KBTD: RES 10K OHM 0.1% 1/10W 0402; Manufacturer: TE Connectivity Passive Product; Power (Watts): 0.1W, 1/10W; Temperature Coefficient: ±25ppm/°C; Part Number: RP73PF1E10KBTD; Value: 10 kOhms; ComponentLink1Description: Datasheet; ComponentLink1URL: https://www.te.com/commerce/DocumentDelivery/DDEController?Action=srchrtrv&DocNm=1773272&DocType=DS&DocLang=English; ComponentLink2Description: DigiKey Link; ComponentLink2URL: https://www.digikey.com/en/products/detail/te-connectivity-passive-product/RP73PF1E10KBTD/8260957; Composition: Thin Film; Device Package: 0402 (1005 Metric); Height - Seated (Max): 0.014" (0.35mm); LastUpdated: 2/9/2024 8:30:24 PM; Lifecycle Status: Active; Minimum Order: 1; Number of Terminations: 2; Operating Temperature: -55°C ~ 155°C; Package / Case: 0402 (1005 Metric); Packaging: TapeAndReel; PartId: 2434; Part Status: Active; Price: 0.08; Resistance: 10 kOhms; Series: RP73, Holsworthy; Size / Dimension: 0.039" L x 0.020" W (1.00mm x 0.50mm); Supplier 1: DigiKey; Supplier Part Number 1: A127415CT-ND; Supplier Device Package: 0402; Tolerance: ±0.1%
R95 R97 R99 R105 = RC0402FR-0722RP: RES 22 OHM 1% 1/16W 0402; Manufacturer: Yageo; Power (Watts): 0.063W, 1/16W; Ratings: 7C1 RoHS w/out Exemption (100% Pb-Free); Temperature Coefficient: ±100ppm/°C; Part Number: RC0402FR-0722RP; Value: 22 Ohms; ComponentLink1Description: Datasheet; ComponentLink1URL: http://www.yageo.com/NewPortal/yageodocoutput?fileName=/pdf/R-Chip/PYu-RC_51_RoHS_P_0.pdf; ComponentLink2Description: DigiKey Link; ComponentLink2URL: https://www.digikey.com/en/products/detail/yageo/RC0402FR-0722RP/4935272; Composition: Thick Film; Device Package: 0402 (1005 Metric); Features: Moisture Resistant; Height - Seated (Max): 0.016" (0.40mm); LastUpdated: 2/9/2024 8:29:38 PM; Lifecycle Status: Active; Minimum Order: 1; Number of Terminations: 2; Operating Temperature: -55°C ~ 155°C; Package / Case: 0402 (1005 Metric); Packaging: CutTape; PartId: 16168; Part Status: Active; Price: 0.01; Resistance: 22 Ohms; Series: RC_P; Size / Dimension: 0.039" L x 0.020" W (1.00mm x 0.50mm); Supplier 1: DigiKey; Supplier Part Number 1: YAG1257CT-ND; Supplier Device Package: 0402; Tolerance: ±1%
S1 = SKRAAME010: Key,6.2mm Square with Middle-travel,0.5mm,50mA,12V DC,¨C40~£«90¡æ,1.96N,SMT,ALPS; Myir P/N: 21201.00008; PCB Footprint: SKRAAME010; Part Type: Key; Manufacturer: ALPS; Manufacturer P/N: SKRAAME010; Reserve Value: SKRAAME010; Datasheet: Connector\Key_ALPS_skra.pdf
U7 = DS3232MZ+TRL: Real Time Clock (RTC) IC Clock/Calendar 236B I²C, 2-Wire Serial 8-SOIC (0.154, 3.90mm Width); Manufacturer: Maxim; Supplier 1: Digikey; Manufacturer Part Number: DS3232MZ+TRL; RoHS: Yes; Category: Real Time Clocks; Stock 1: 40000; Pricing 1: 2500=5.252 (USD); ComponentLink1URL: https://datasheet.ciiva.com/12291/ds3232m-95532-12291172.pdf?src-supplier=Mouser; ComponentLink1Description: https://datasheet.ciiva.com/12291/ds3232m-95532-12291172.pdf?src-supplier=Mouser; ComponentLink2URL: https://datasheet.ciiva.com/14085/ds3232m-14085670.pdf?src-supplier=Digikey; ComponentLink2Description: https://datasheet.ciiva.com/14085/ds3232m-14085670.pdf?src-supplier=Digikey; ComponentLink3URL: https://datasheet.ciiva.com/14196/ds3232m-14196620.pdf?src-supplier=Avnet; ComponentLink3Description: https://datasheet.ciiva.com/14196/ds3232m-14196620.pdf?src-supplier=Avnet; Supplier Part Number 1: DS3232MZ+TRLTR-ND

## Sheet 13_LED_BACKLIGHT.SchDoc: =TitleParameter
size A3; Address: Crete IL; Organization: ASISGUARD; Address1: Kemalpasa, Kemalpasa Cd. No:290 D:292H, 35060 Bornova/Izmir/Turkey; Revision: R1M1
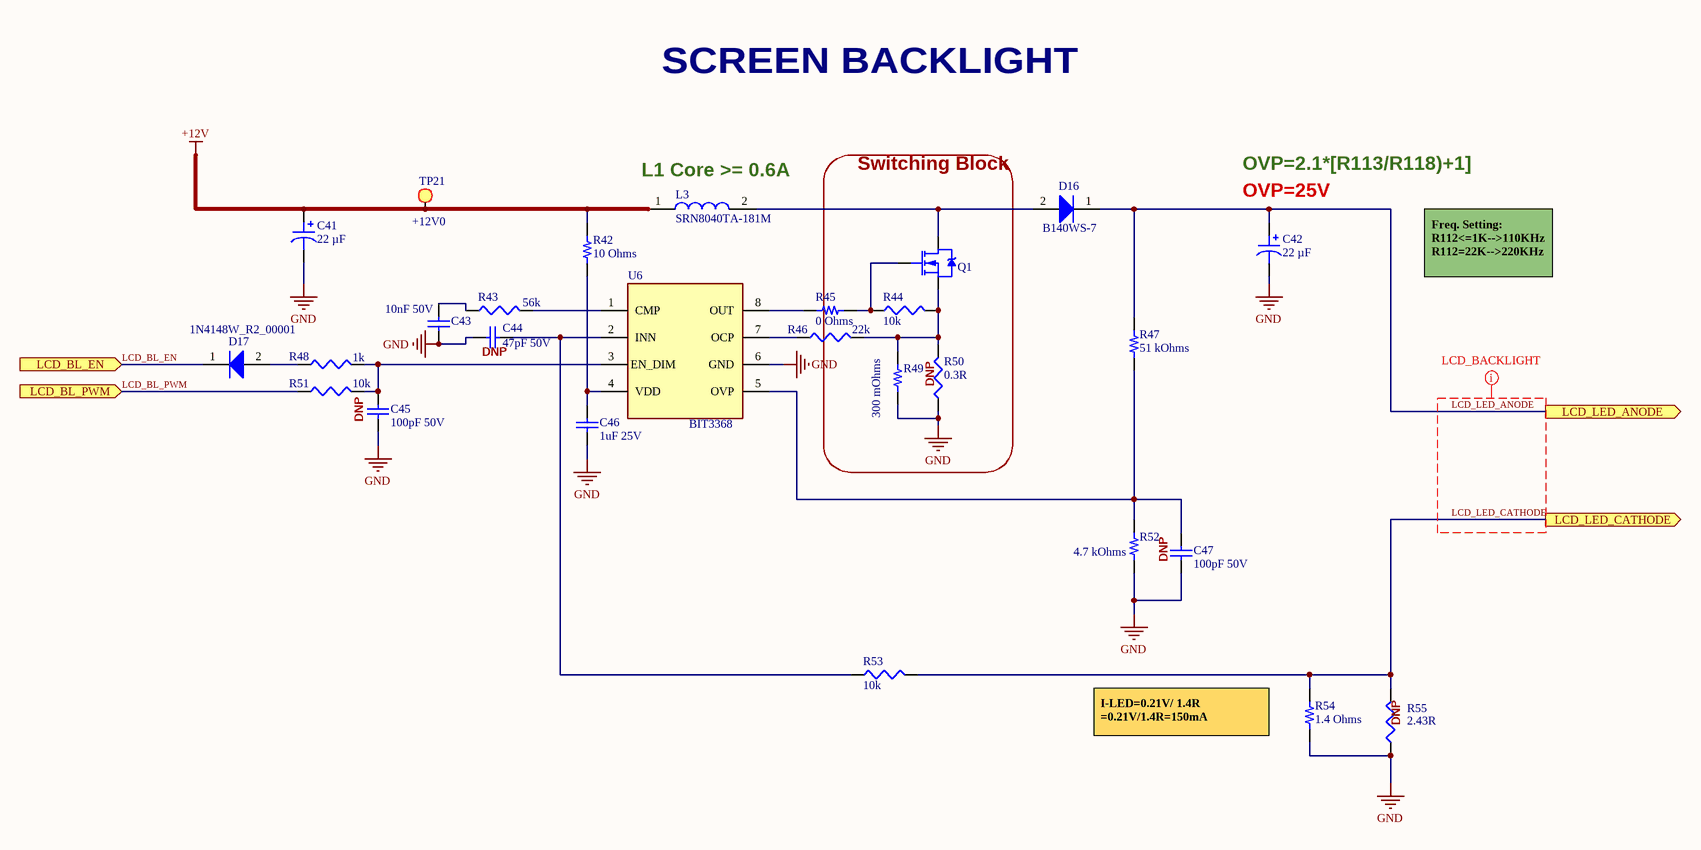
[diagram p12: 13_LED_BACKLIGHT.SchDoc]

### Parts
C41  22 µF  [CAP ALSMD 6.6MM H5.4MM]
C42  22 µF  [CAP ALSMD 6.6MM H5.4MM]
C43  value 10nF 50V  [SMC0603]  (hidden comment: CAP CER 10000PF 50V X7R 0603)
C44  value 47pF 50V  [SMC0603]  (hidden comment: CAP CER 47PF 50V C0G/NPO 0603)
C45  value 100pF 50V  [SMC0603]  (hidden comment: CAP CER 100PF 50V C0G/NP0 0603)
C46  value 1uF 25V  [SMC0603]  (hidden comment: CAP CER 1UF 25V X5R 0603)
C47  value 100pF 50V  [SMC0603]  (hidden comment: CAP CER 100PF 50V C0G/NP0 0603)
D16  Manufacturer Part Number: B140WS-7  [SOD-323_L1.8-W1.3-LS2.5-RD]  (hidden comment: DIODE SCHOTTKY 40V 1A SOD323)
D17  Diode 75 V 200mA Surface Mount SOD-123  [SOD-123_L2.8-W1.8-LS3.7-RD]  (value not drawn)
L3  SRN8040TA-181M  [INDPM8080X450N]
Q1  MOSFET N-CH 100V 30A TO252-3  [TO-252_L6.5-W6.1-P4.58-LS9.9-BR]  (value not drawn)
R42  10 Ohms  [RES 0805_2012]
R43  value 56k  [SMR0603]  (hidden comment: RES 56K OHM 1% 1/10W 0603)
R44  value 10k  [SMR0603]  (hidden comment: RES 10K OHM 1% 1/10W 0603)
R45  0 Ohms  [RES 0603_1608]
R46  value 22k  [SMR0603]  (hidden comment: RES 22K OHM 1% 1/10W 0603)
R47  51 kOhms  [RES 0603_1608]
R48  value 1k  [SMR0603]  (hidden comment: RES 1K OHM 1% 1/10W 0603)
R49  300 mOhms  [RES 0805_2012]
R50  value 0.3R  [SMR0805]  (hidden comment: 125mW Thick Film Resistors ±1% 300mΩ 0805 Chip Resistor - Surface Mount ROHS)
R51  value 10k  [SMR0603]  (hidden comment: RES 10K OHM 1% 1/10W 0603)
R52  4.7 kOhms  [RES 0603_1608]
R53  value 10k  [SMR0603]  (hidden comment: RES 10K OHM 1% 1/10W 0603)
R54  1.4 Ohms  [RES 0805_2012]
R55  value 2.43R  [SMR0805]  (hidden comment: 125mW Thick Film Resistors ±1% 2.43Ω 0805 Chip Resistor - Surface Mount ROHS)
TP21  +12V0  [TEST_POINT]
U6  BIT3368 LED DRIVER CONTROLLER  [SOP-8_L4.9-W3.9-P1.27-LS6.0-BL]  (value not drawn)

### Blocks framed on the sheet
Switching Block: Q1 R44-R46 R49 R50

### Ports
LCD_BL_EN (in), LCD_BL_PWM (in), LCD_LED_ANODE (out), LCD_LED_CATHODE (out)

### Nets
+12V: C41.1 L3.1 R42.2 TP21.1(TP)
GND: C41.2 C42.2 C43.1 C44.1 C45.1 C46.1 C47.1 R49.1 R50.1 R52.1 R54.1 R55.1 U6.6(GND)
LCD_BL_EN: D17.1(K) ; port LCD_BL_EN
LCD_BL_PWM: R51.1 ; port LCD_BL_PWM
LCD_LED_ANODE: C42.1 D16.1(K) R47.2 ; port LCD_LED_ANODE
LCD_LED_CATHODE: R53.2 R54.2 R55.2 ; port LCD_LED_CATHODE
NetC43_2: C43.2 R43.1
NetC44_2: C44.2 R53.1 U6.2(INN)
NetC45_2: C45.2 R48.2 R51.2 U6.3(EN_DIM)
NetC46_2: C46.2 R42.1 U6.4(VDD)
NetC47_2: C47.2 R47.1 R52.2 U6.5(OVP)
NetD16_2: D16.2(A) L3.2 Q1.2(D)
NetD17_2: D17.2(A) R48.1
NetQ1_1: Q1.1(G) R44.1 R45.2
NetQ1_3: Q1.3(S) R44.2 R46.2 R49.2 R50.2
NetR43_2: R43.2 U6.1(CMP)
NetR45_1: R45.1 U6.8(OUT)
NetR46_1: R46.1 U6.7(OCP)

### Layout directives
net class LCD_BACKLIGHT: LCD_LED_ANODE, LCD_LED_CATHODE

### Notes on the sheet
- SCREEN BACKLIGHT
- (near L3) L1 Core >= 0.6A
- OVP=2.1*[R113/R118)+1]
- (near C42) OVP=25V
- Freq. Setting:
  R112<=1K-->110KHz
  R112=22K-->220KHz
- (near C44) DNP
- DNP
- (near R50) DNP
- (near C47) DNP
- (near R54) I-LED=0.21V/ 1.4R
  =0.21V/1.4R=150mA
- (near R55) DNP
- Proje/Project:
- Sayfa Adı/Document Name:
- Çizilme Tarihi/Drawing Date
- Umit KAYACIK
- Tasarlayan/Designed By
- Sayfa/Sheet:
- Revision:
- of
- Son Güncelleme/Last Edit Date
- Kontrol eden/Checked By
- Onaylayan/Approved By
- Boyut/Size:
- Varyant/Variant:
- Dil/Language:
- A3
- ENG

### Library data of the parts
C41 C42 = 865080643008: CAP ALUM 22UF 20% 50V SMD; manufacturer: Würth Elektronik; Impedance: 1.3 Ohms; Lifetime @ Temp.: 2000 Hrs @ 105°C; Polarization: Polar; Ripple Current @ High Frequency: 150 mA @ 100 kHz; Ripple Current @ Low Frequency: 97.5 mA @ 120 Hz; Surface Mount Land Size: 0.260" L x 0.260" W (6.60mm x 6.60mm); Part Number: 865080643008; Applications: General Purpose; Capacitance: 22 µF; componentlink1description: Datasheet; componentlink1url: https://katalog.we-online.de/pbs/datasheet/865080643008.pdf; componentlink2description: DigiKey Link; componentlink2url: https://www.digikey.com/en/products/detail/würth-elektronik/865080643008/5728048; Device Package: Radial, Can - SMD; Height - Seated (Max): 0.217" (5.50mm); lastupdated: 3/11/2024 7:45:23 AM; Lifecycle Status: Active; Minimum Order: 1; Mounting Type: Surface Mount; Operating Temperature: -55°C ~ 105°C; Package / Case: Radial, Can - SMD; packaging: TapeAndReel; partid: 8986; Part Status: Active; price: 0.15; series: WCAP-ASLI; Size / Dimension: 0.248" Dia (6.30mm); Supplier 1: DigiKey; Supplier Part Number 1: 732-8453-1-ND; Tolerance: ±20%; value: 22 µF; Voltage - Rated: 50 V
C43 = CAP0603_10NF_50V: 10000 pF ±10% 50V Ceramic Capacitor X7R 0603 (1608 Metric); Manufacturer Part Number: CL10B103KB8NNNC; Order Code: DIGI : 1276-1009-2-ND; LCSC Manufacturer Part Number: CL10B103KB8NNNC; LCSC Part Number: C1589
C44 = CAP0603_47PF_50V: 47 pF ±5% 50V Ceramic Capacitor C0G, NP0 0603 (1608 Metric); Manufacturer Part Number: CC0603JRNPO9BN470; Order Code: DIGI : 311-1065-2-ND; LCSC Manufacturer Part Number: CC0603JRNPO9BN470; LCSC Part Number: C105622
C45 C47 = CAP0603_100PF_50V: 100 pF ±5% 50V Ceramic Capacitor C0G, NP0 0603 (1608 Metric); Manufacturer Part Number: 06035A101JAT2A; LCSC Manufacturer Part Number: CC0603JRNPO9BN101; Order Code: DIGI: 478-1175-2-ND; Sirius Stock Code: *; LCSC Part Number: C14665
C46 = CAP0603_1UF_50V: 1 µF ±10% 25V Ceramic Capacitor X5R 0603 (1608 Metric); Manufacturer Part Number: CL10A105KA8NNNC; Order Code: Digi: 1276-1102-2-ND; Sirius Stock Code: *; LCSC Part Number: C5673; LCSC Manufacturer Part Number: CL10A105KA8NNNC
D16 = BS140WS-7: Diode 40 V 1A Surface Mount SOD-323; Order Code: Digi: B140WS-7DITR-ND; LCSC Manufacturer Part Number: B140WS-7; LCSC Part Number: C95171
D17 = 1N4148W_R2_00001: Manufacturer Part Number: 1N4148W_R2_00001
L3 = SRN8040TA-181M: FIXED IND 180UH 910MA 490MOHM SM; Manufacturer_Name: Bourns; Datasheet Link: http://www.bourns.com/docs/Product-Datasheets/SRN8040TA.pdf; Height: 4.5mm; Manufacturer_Part_Number: SRN8040TA-181M; Mouser Part Number: 652-SRN8040TA-181M; Mouser Price/Stock: https://www.mouser.co.uk/ProductDetail/Bourns/SRN8040TA-181M?qs=Vt59ZOdFuWYBehGVtqRu4w%3D%3D; Arrow Part Number: SRN8040TA-181M; Arrow Price/Stock: https://www.arrow.com/en/products/srn8040ta-181m/bourns?region=nac
Q1 = IPD30N10S3L34ATMA1: N-Channel 100 V 30A (Tc) 57W (Tc) Surface Mount PG-TO252-3-11; Manufacturer Part Number: IPD30N10S3L34ATMA1; Value: N-Channel 100 V 30A (Tc) 57W (Tc) Surface Mount PG-TO252-3-11
R42 = MCU08050C1009FP500: RES SMD 10 OHM 1% 1/5W 0805; Manufacturer: Vishay Beyschlag; Power (Watts): 0.2W, 1/5W; Temperature Coefficient: ±50ppm/°C; Part Number: MCU08050C1009FP500; Value: 10 Ohms; ComponentLink1Description: Datasheet; ComponentLink1URL: http://www.vishay.com/docs/28705/mcx0x0xpro.pdf; ComponentLink2Description: DigiKey Link; ComponentLink2URL: http://digikey.com/product-detail/en/vishay-beyschlag/MCU08050C1009FP500/749-1723-1-ND/7348031; Composition: Thin Film; Device Package: 0805 (2012 Metric); Features: Anti-Sulfur; Height - Seated (Max): 0.022" (0.55mm); LastUpdated: 2/8/2024 9:02:08 PM; Lifecycle Status: Active; Minimum Order: 1; Number of Terminations: 2; Operating Temperature: -55°C ~ 155°C; Package / Case: 0805 (2012 Metric); Packaging: TapeAndReel; PartId: 34857; Part Status: Active; Price: 0.07; Resistance: 10 Ohms; Series: MCU - Professional; Size / Dimension: 0.079" L x 0.049" W (2.00mm x 1.25mm); Supplier 1: DigiKey; Supplier Part Number 1: 749-1723-1-ND; Supplier Device Package: 0805; Tolerance: ±1%
R43 = RES0603_56K_%1: 56 kOhms ±1% 0.1W, 1/10W Chip Resistor 0603 (1608 Metric) Moisture Resistant Thick Film; Manufacturer Part Number: RC0603FR-0756KL; Order Code: Digi: 311-56KHRTR-ND; Sirius Stock Code: *; LCSC Part Number: C114630; LCSC Manufacturer Part Number: RC0603FR-0756KL
R44 R51 R53 = RES0603_10K_%1: 10 kOhms ±1% 0.1W, 1/10W Chip Resistor 0603 (1608 Metric) Moisture Resistant Thick Film; Manufacturer Part Number: RC0603FR-0710KL; Order Code: Digi: 311-10.0KHRTR-ND; Sirius Stock Code: *; LCSC Part Number: C98220; LCSC Manufacturer Part Number: RC0603FR-0710KL
R45 = RC0603JR-070RL: RES 0 OHM JUMPER 1/10W 0603; Manufacturer: Yageo; Power (Watts): 0.1W, 1/10W; Part Number: RC0603JR-070RL; Value: 0 Ohms; ComponentLink1Description: Datasheet; ComponentLink1URL: https://www.yageo.com/upload/media/product/productsearch/datasheet/rchip/PYu-RC_Group_51_RoHS_L_10.pdf; ComponentLink2Description: DigiKey Link; ComponentLink2URL: https://www.digikey.com/en/products/detail/yageo/RC0603JR-070RL/726675; Composition: Thick Film; Device Package: 0603 (1608 Metric); Features: Moisture Resistant; Height - Seated (Max): 0.022" (0.55mm); LastUpdated: 2/9/2024 8:42:27 PM; Lifecycle Status: Active; Minimum Order: 1; Number of Terminations: 2; Operating Temperature: -55°C ~ 155°C; Package / Case: 0603 (1608 Metric); Packaging: CutTape; PartId: 22595; Part Status: Active; Price: 0.01; Resistance: 0 Ohms; Series: RC_L; Size / Dimension: 0.063" L x 0.031" W (1.60mm x 0.80mm); Supplier 1: DigiKey; Supplier Part Number 1: 311-0.0GRCT-ND; Supplier Device Package: 0603; Tolerance: Jumper
R46 = RES0603_22K_%1: 22K; Manufacturer Part Number: RC0603FR-0722KL; Order Code: Digi: 311-22.0KHRTR-ND; Sirius Stock Code: *; LCSC Part Number: C114065; LCSC Manufacturer Part Number: RC0603FR-0722KL
R47 = CRCW060351K0FKEA: RES SMD 51K OHM 1% 1/10W 0603; Manufacturer: Vishay Dale; Power (Watts): 0.1W, 1/10W; Temperature Coefficient: ±100ppm/°C; Part Number: CRCW060351K0FKEA; Value: 51 kOhms; ComponentLink1Description: Datasheet; ComponentLink1URL: http://www.vishay.com/docs/20035/dcrcwe3.pdf; ComponentLink2Description: DigiKey Link; ComponentLink2URL: https://www.digikey.com/en/products/detail/vishay-dale/CRCW060351K0FKEA/1174862; Composition: Thick Film; Device Package: 0603 (1608 Metric); Features: Automotive AEC-Q200; Height - Seated (Max): 0.020" (0.50mm); LastUpdated: 2/9/2024 8:43:25 PM; Lifecycle Status: Active; Minimum Order: 1; Number of Terminations: 2; Operating Temperature: -55°C ~ 155°C; Package / Case: 0603 (1608 Metric); Packaging: TapeAndReel; PartId: 7831; Part Status: Active; Price: 0.01; Ratings: AEC-Q200; Resistance: 51 kOhms; Series: CRCW; Size / Dimension: 0.061" L x 0.033" W (1.55mm x 0.85mm); Supplier 1: DigiKey; Supplier Part Number 1: 541-51.0KHCT-ND; Supplier Device Package: 0603; Tolerance: ±1%
R48 = RES0603_1K_%1: 1 kOhms ±1% 0.1W, 1/10W Chip Resistor 0603 (1608 Metric) Moisture Resistant Thick Film; Manufacturer Part Number: RC0603FR-071KL; Order Code: Digi: 311-1.00KHRTR-ND; Sirius Stock Code: *; LCSC Part Number: C22548; LCSC Manufacturer Part Number: RC0603FR-071KL
R49 = CSR0805FKR300: RES 0.3 OHM 1% 1/4W 0805; Manufacturer: Stackpole Electronics Inc; Power (Watts): 0.25W, 1/4W; Temperature Coefficient: ±200ppm/°C; Part Number: CSR0805FKR300; Value: 300 mOhms; ComponentLink1Description: Datasheet; ComponentLink1URL: https://www.seielect.com/catalog/sei-csr_csrn.pdf; ComponentLink2Description: DigiKey Link; ComponentLink2URL: https://www.digikey.com/en/products/detail/stackpole-electronics-inc/CSR0805FKR300/1742448; Composition: Thick Film; Device Package: 0805 (2012 Metric); Features: Current Sense; Height - Seated (Max): 0.026" (0.65mm); LastUpdated: 2/8/2024 9:02:29 PM; Lifecycle Status: Active; Minimum Order: 1; Number of Terminations: 2; Operating Temperature: -55°C ~ 155°C; Package / Case: 0805 (2012 Metric); Packaging: TapeAndReel; PartId: 29999; Part Status: Active; Price: 0.05; Resistance: 300 mOhms; Series: CSR; Size / Dimension: 0.079" L x 0.049" W (2.00mm x 1.25mm); Supplier 1: DigiKey; Supplier Part Number 1: CSR0805FKR300CT-ND; Supplier Device Package: 0805; Tolerance: ±1%
R50 = RES0805_0.3R_%1: Manufacturer Part Number: 0805W8F300LT5E; Order Code: LCSC: C247157; LCSC Manufacturer Part Number: 0805W8F300LT5E; LCSC Part Number: C247157
R52 = ERA-3AEB472V: RES SMD 4.7K OHM 0.1% 1/10W 0603; Manufacturer: Panasonic Electronic Components; Power (Watts): 0.1W, 1/10W; Temperature Coefficient: ±25ppm/°C; Part Number: ERA-3AEB472V; Value: 4.7 kOhms; ComponentLink1Description: Datasheet; ComponentLink1URL: https://industrial.panasonic.com/cdbs/www-data/pdf/RDM0000/AOA0000C307.pdf; ComponentLink2Description: DigiKey Link; ComponentLink2URL: https://www.digikey.com/en/products/detail/panasonic-electronic-components/ERA-3AEB472V/1465870; Composition: Thin Film; Device Package: 0603 (1608 Metric); Features: Automotive AEC-Q200; Height - Seated (Max): 0.022" (0.55mm); LastUpdated: 2/9/2024 8:43:34 PM; Lifecycle Status: Active; Minimum Order: 1; Number of Terminations: 2; Operating Temperature: -55°C ~ 155°C; Package / Case: 0603 (1608 Metric); Packaging: TapeAndReel; PartId: 5519; Part Status: Active; Price: 0.03; Ratings: AEC-Q200; Resistance: 4.7 kOhms; Series: ERA-3A; Size / Dimension: 0.063" L x 0.031" W (1.60mm x 0.80mm); Supplier 1: DigiKey; Supplier Part Number 1: P4.7KDBCT-ND; Supplier Device Package: 0603; Tolerance: ±0.1%
R54 = RK73H2ATTD1R40F: RES 1.4 OHM 1% 1/4W 0805; Manufacturer: KOA Speer Electronics, Inc.; Power (Watts): 0.25W, 1/4W; Temperature Coefficient: ±200ppm/°C; Part Number: RK73H2ATTD1R40F; Value: 1.4 Ohms; ComponentLink1Description: Datasheet; ComponentLink1URL: https://www.koaspeer.com/pdfs/RK73H.pdf; ComponentLink2Description: DigiKey Link; ComponentLink2URL: https://www.digikey.com/en/products/detail/koa-speer-electronics-inc/RK73H2ATTD1R40F/10228601; Composition: Thick Film; Device Package: 0805 (2012 Metric); Features: Automotive AEC-Q200, Moisture Resistant; Height - Seated (Max): 0.024" (0.60mm); LastUpdated: 2/8/2024 9:00:36 PM; Lifecycle Status: Active; Minimum Order: 1; Number of Terminations: 2; Operating Temperature: -55°C ~ 155°C; Package / Case: 0805 (2012 Metric); Packaging: TapeAndReel; PartId: 61343; Part Status: Active; Price: 0.01; Ratings: AEC-Q200; Resistance: 1.4 Ohms; Series: RK73H; Size / Dimension: 0.079" L x 0.049" W (2.00mm x 1.25mm); Supplier 1: DigiKey; Supplier Part Number 1: 2019-RK73H2ATTD1R40FCT-ND; Supplier Device Package: 0805; Tolerance: ±1%
R55 = RES0805_2R43_%1: Manufacturer Part Number: FRC0805F2R43TS; Order Code: LCSC: C2933405; LCSC Manufacturer Part Number: FRC0805F2R43TS; LCSC Part Number: C2933405
TP21 = TP_1
U6 = BIT3368: High Performance PWM Controller; Manufacturer: BITEK; LSCS Part Number: C5252694; Manufacturer Part Number: BIT3368